# Altium schematic sheet Spindle_Sync.SchDoc: STM32F446 CNC
size B; Author: AM; CompanyName: Expatria Technologies; DrawnBy: A.Marles; Engineer: AM; Organization: Expatria Technolgoies; DocumentNumber: 11; Revision: A1; SheetNumber: 11; SheetTotal: 14
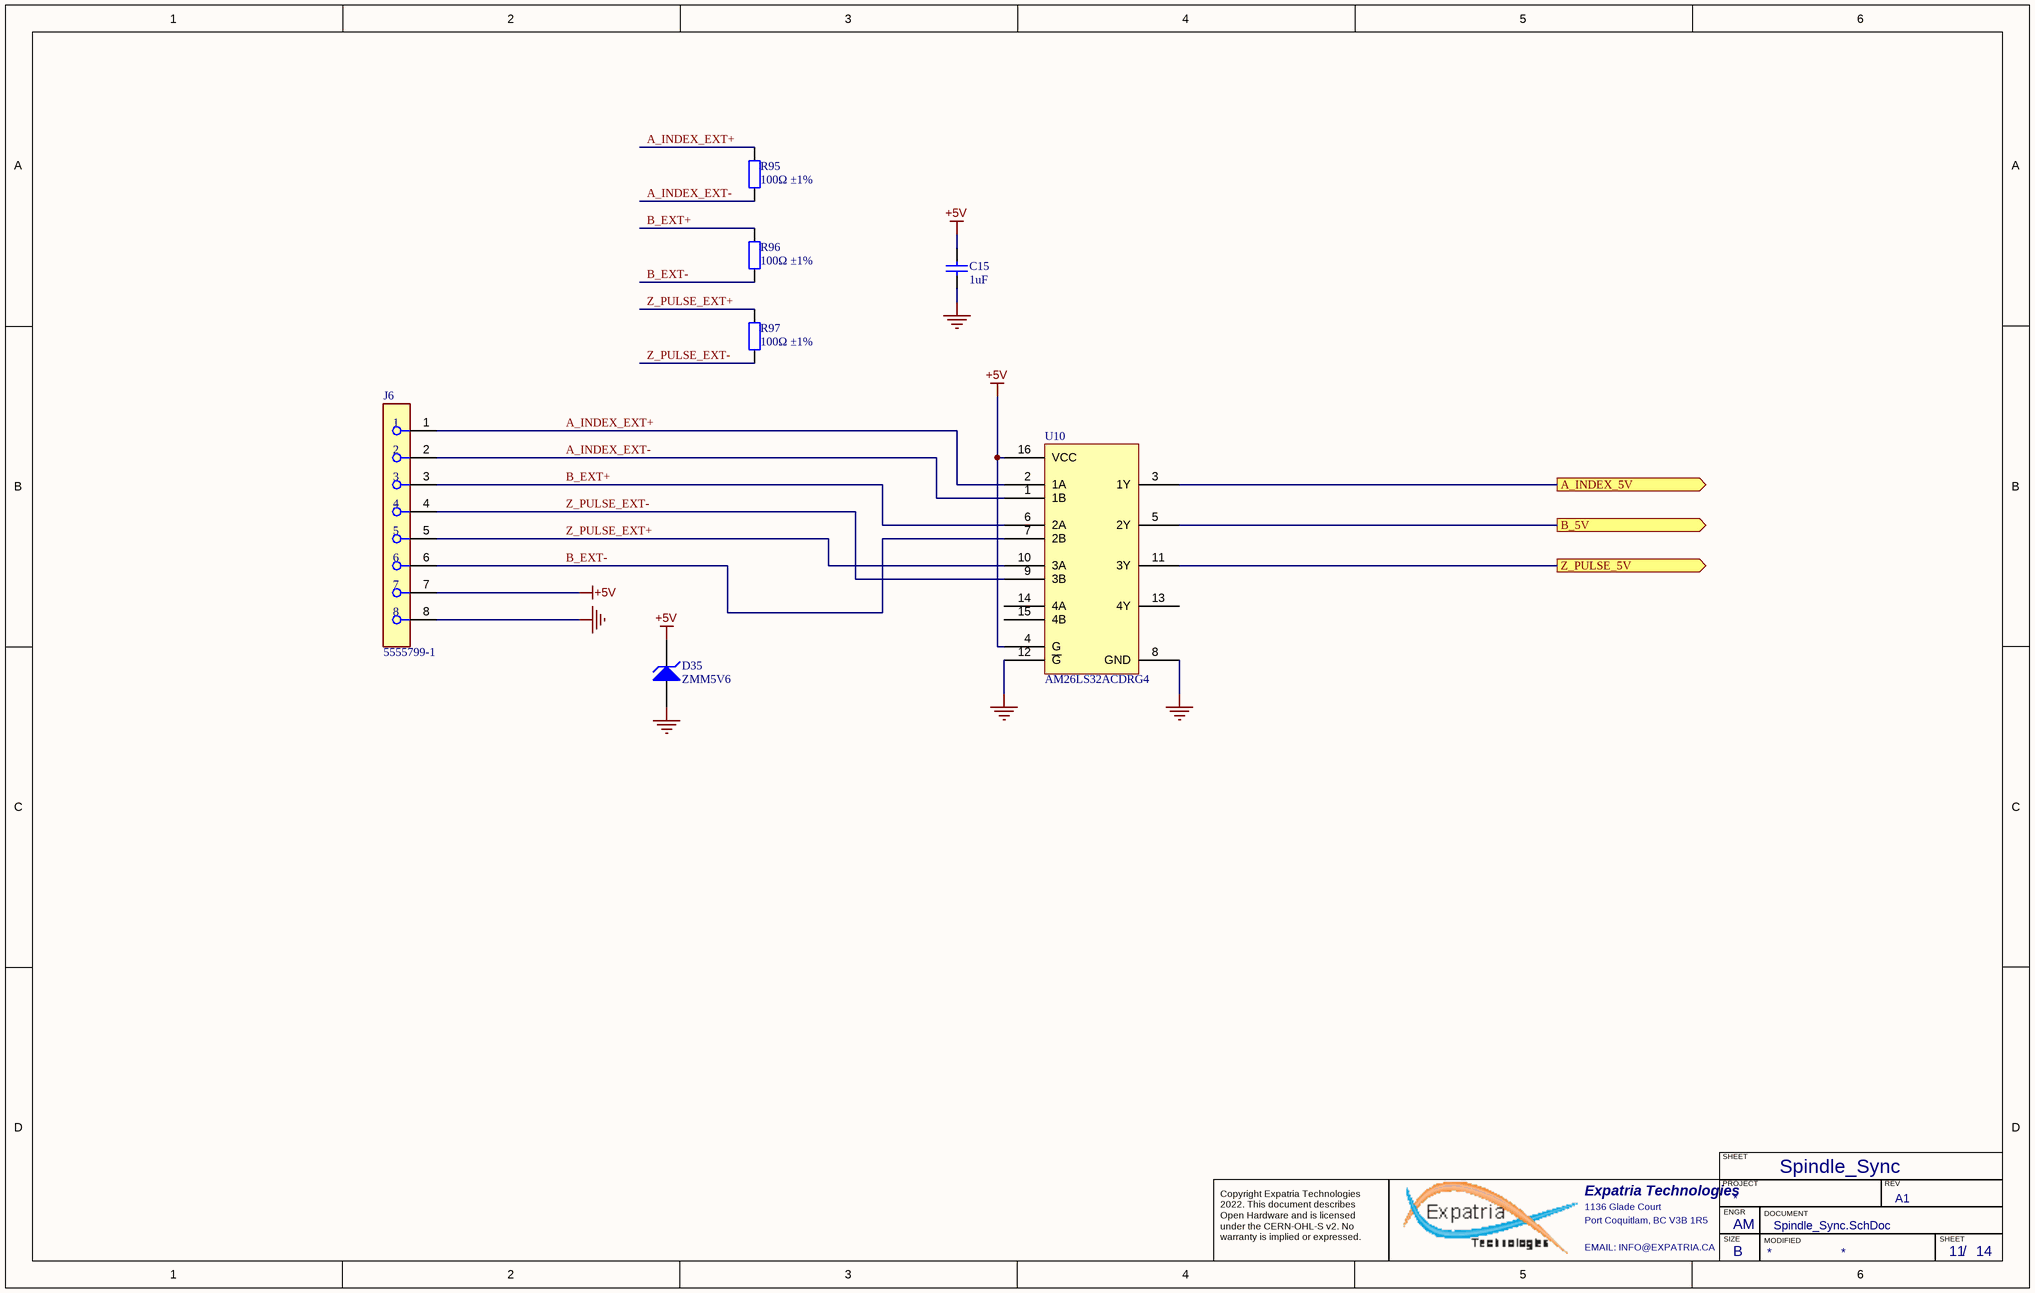
[diagram p0: Spindle_Sync.SchDoc]

## Parts
C15  1uF  [0603_C]
D35  ZMM5V6  [LL-34]
J6  5555799-1  [FP-5555799-1-MFG]
R95  100Ω ±1%  [0603_R]
R96  100Ω ±1%  [0603_R]
R97  100Ω ±1%  [0603_R]
U10  AM26LS32ACDRG4  [SOIC-16_150mil]

## Ports
A_INDEX_5V (out), B_5V (out), Z_PULSE_5V (out)

## Nets
+5V: C15.2 D35.2(K) J6.7 U10.4(G) U10.16(VCC)
GND: C15.1 D35.1(A) J6.8 U10.8(GND) U10.12(~{G})
A_INDEX_5V: U10.3(1Y) ; port A_INDEX_5V
A_INDEX_EXT+: J6.1 R95.2 U10.2(1A)
A_INDEX_EXT-: J6.2 R95.1 U10.1(1B)
B_5V: U10.5(2Y) ; port B_5V
B_EXT+: J6.3 R96.2 U10.6(2A)
B_EXT-: J6.6 R96.1 U10.7(2B)
Z_PULSE_5V: U10.11(3Y) ; port Z_PULSE_5V
Z_PULSE_EXT+: J6.5 R97.2 U10.10(3A)
Z_PULSE_EXT-: J6.4 R97.1 U10.9(3B)

Not connected (* = marked no-connect by the designer): U10 13(4Y) 14(4A) 15(4B)

## Notes on the sheet
- Spindle_Sync
- SHEET
- Expatria Technologies
- 1136 Glade Court
- Port Coquitlam, BC V3B 1R5
- PROJECT
- SIZE
- ENGR
- MODIFIED
- DOCUMENT
- REV
- Copyright Expatria Technologies 2022. This document describes Open Hardware and is licensed under the CERN-OHL-S v2. No warranty is implied or expressed.
- EMAIL: INFO@EXPATRIA.CA
- B
- /

## Library data of the parts
C15 = 0603 1uF (105) 10% 50V: Chip capacitors; Manufacturer: Samsung Electro-Mechanics; PartNumber: CL10A105KB8NNNC; Tolerance: 10%; Voltage: 50V; ComponentLink1Description: Supplier link; ComponentLink1URL: http://www.szlcsc.com/product/details_16531.html; Package: 0603; Supplier: LC; SuppliersPartNumber: C15849; Capacitance: 1uF
D35 = LL-34 ZMM5V6: 500mW - 0.1uA @ 1V 5.6V LL-34 Zener Diodes ROHS; ComponentLink1Description: 供应商链接; ComponentLink1URL: http://www.szlcsc.com/product/details_8541.html; Package: LL-34; Supplier: LC; SuppliersPartNumber: C8062
J6 = CMP-03371-000003-1: CONN MOD JACK 8P8C VERT UNSHLD; Manufacturer: TE Connectivity; Pitch: 2.54mm; Number Of Contacts: 8; Is Female: yes; Device Class L3: unset; Temperature Range High: +85°C; Temperature Range Low: -40°C; Octopart: https://octopart.com/5555799-1-te+connectivity-39526335; Device Class L1: Connectors; Device Class L2: Modular / Ethernet Connectors; Mouser Description: Conn RJ-45 F 8 POS 2.54mm Solder ST Thru-Hole 8 Terminal 1 Port Cat 3 Box/Package/Tray; Digikey Description: CONN MOD JACK 8P8C VERT UNSHLD; Package: 5555799-1; Temperature: -40°C to +85°C; SuppliersPartNumber: C305983; Manufacturer 1: TE Connectivity; Manufacturer Part Number 1: 5555799-1
R95-R97 = 0603 100R (1000) 1%: Chip resistor; Manufacturer: Uniroyal Elec; PartNumber: 0603WAF1000T5E; Power: 1/10W; ComponentLink1Description: Supplier link; ComponentLink1URL: http://www.szlcsc.com/product/details_23502.html; Package: 0603; Supplier: LC; SuppliersPartNumber: C22775; Resistance: 100Ω; Tolerance: 1%
U10 = AM26LS32ACDRG4_[C6180]: RS-422 Interface IC Quad Diff Line Rcvr; ComponentLink1Description: 供应商链接; ComponentLink1URL: http://www.szlcsc.com/product/details_6646.html; Package: SOIC-16_150mil; Supplier: LC; SuppliersPartNumber: C6180